# Altium project Camera_Module_Adopter.PrjPcb
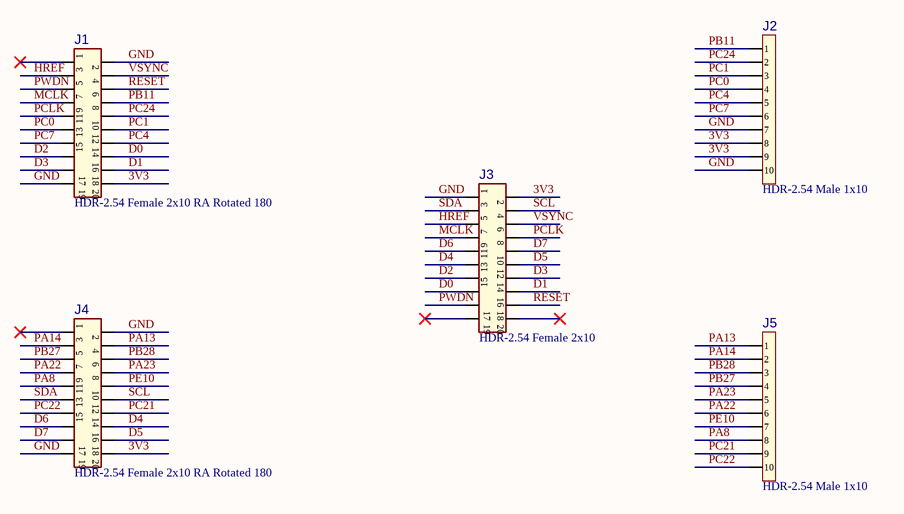
[diagram p0: Sheet1.SchDoc]
1 sheet, 5 parts. Net scope: global (net labels, ports and power ports of the same name join across sheets).
Board file: PCB1.PcbDoc

## Sheet Sheet1.SchDoc
size A; SheetNumber: 1; SheetTotal: 1

### Parts
J1  value HDR-2.54 Female 2x10 RA Rotated 180  [HDR_F_2.54_2x10_RA_180]  (hidden comment: Header 2x10)
J2  value HDR-2.54 Male 1x10  [HDR_M_2.54_1x10]  (hidden comment: Header 1x10)
J3  value HDR-2.54 Female 2x10  [HDR_F_2.54_2x10_SFH11-PBPC-D10-ST-BK]  (hidden comment: Header 2x10)
J4  value HDR-2.54 Female 2x10 RA Rotated 180  [HDR_F_2.54_2x10_RA_180]  (hidden comment: Header 2x10)
J5  value HDR-2.54 Male 1x10  [HDR_M_2.54_1x10]  (hidden comment: Header 1x10)

### Nets
3V3: J1.20 J2.8 J2.9 J3.2 J4.20
D0: J1.16 J3.15
D1: J1.18 J3.16
D2: J1.15 J3.13
D3: J1.17 J3.14
D4: J3.11 J4.16
D5: J3.12 J4.18
D6: J3.9 J4.15
D7: J3.10 J4.17
GND: J1.2 J1.19 J2.7 J2.10 J3.1 J4.2 J4.19
HREF: J1.3 J3.5
MCLK: J1.7 J3.7
PA8: J4.9 J5.8
PA13: J4.4 J5.1
PA14: J4.3 J5.2
PA22: J4.7 J5.6
PA23: J4.8 J5.5
PB11: J1.8 J2.1
PB27: J4.5 J5.4
PB28: J4.6 J5.3
PC0: J1.11 J2.4
PC1: J1.12 J2.3
PC4: J1.14 J2.5
PC7: J1.13 J2.6
PC21: J4.14 J5.9
PC22: J4.13 J5.10
PC24: J1.10 J2.2
PCLK: J1.9 J3.8
PE10: J4.10 J5.7
PWDN: J1.5 J3.17
RESET: J1.6 J3.18
SCL: J3.4 J4.12
SDA: J3.3 J4.11
VSYNC: J1.4 J3.6

Not connected (* = marked no-connect by the designer): J1 1*; J3 19* 20*; J4 1*

### Library data of the parts
J1 J4 = CON1532: Manufacturer 1: Sullins Connector Solutions; Manufacturer Part Number 1: PPPC102LJBN-RC; Description_: CON HDR-2.54 Female 2x10 Rotated 180Degrees Gold TH RT ANGLE; Dev Tools Status: Production; Owner: Jamus Griego; Populated: YES; Restricted Sourcing: No; MCHP-ID: CON1532; Revision: 1; Symbol: Header 2x10; Status: MCL Design; ComponentLink1URL: https://chn-vm-apps.microchip.com/mchprepo/parts/Datasheets/101_P(N)PxCxx2LJBN-RC,_10494-H.pdf; ComponentLink1Description: SVN Datasheet; ComponentLink2URL: C:\ALTIUM_WORK\00001_MCHP-CDB\Datasheets\101_P(N)PxCxx2LJBN-RC,_10494-H.pdf; ComponentLink2Description: Local Datasheet; ComponentLink3URL: C:\ALTIUM_WORK\00001_MCHP-CDB\Library\LibraryRefs\Header 2x10.SchLib; ComponentLink3Description: Open Symbol; ComponentLink4URL: C:\ALTIUM_WORK\00001_MCHP-CDB\Library\Footprints\HDR_F_2.54_2x10_RA_180.PcbLib; ComponentLink4Description: Open Footprint; ComponentLink5Description: Open Footprint 2; ComponentLink6Description: Open Footprint 3; ComponentLink7Description: Open Footprint 4; Type: Header 2.54mm; Category: Connector; Supplier 1: Digi-Key; Supplier Part Number 1: S5563-ND; Quantity Override: 1
J2 J5 = CON0105: Manufacturer 1: Aceconn Technology (Shenzhen); Manufacturer Part Number 1: GPHA101-1002A001B1BA; Description_: CON HDR-2.54 Male 1x10 Gold 5.84MH TH VERT; Dev Tools Status: Production; Populated: Yes; Restricted Sourcing: No; MCHP-ID: CON0105; Revision: 3; Symbol: Header 1x10; Status: MCL Design; ComponentLink1URL: https://chn-vm-apps.microchip.com/mchprepo/parts/Datasheets/TSW-XXX-XX-XXX-X-XX-XXX-MKT.pdf; ComponentLink1Description: SVN Datasheet; ComponentLink2URL: C:\ALTIUM_WORK\00001_MCHP-CDB\Datasheets\TSW-XXX-XX-XXX-X-XX-XXX-MKT.pdf; ComponentLink2Description: Local Datasheet; ComponentLink3URL: C:\ALTIUM_WORK\00001_MCHP-CDB\Library\LibraryRefs\Header 1x10.SchLib; ComponentLink3Description: Open Symbol; ComponentLink4URL: C:\ALTIUM_WORK\00001_MCHP-CDB\Library\Footprints\HDR_M_2.54_1x10.PcbLib; ComponentLink4Description: Open Footprint; ComponentLink5Description: Open Footprint 2; ComponentLink6Description: Open Footprint 3; ComponentLink7Description: Open Footprint 4; Type: Header 2.54mm; Category: Connector; Manufacturer 2: Samtec Inc.; Manufacturer Part Number 2: TSW-110-07-G-S; Manufacturer 3: Samtec Inc.; Manufacturer Part Number 3: TSW-110-07-S-S; Manufacturer 4: Samtec Inc.; Manufacturer Part Number 4: TSW-110-07-L-S; Supplier 1: Aceconn Technology (Shenzhen); Supplier Part Number 1: GPHA101-1002A001B1BA; Supplier 2: Digi-Key; Supplier Part Number 2: SAM1029-10-ND; Supplier 3: Digi-Key; Supplier Part Number 3: SAM1033-10-ND; Supplier 4: Digi-Key; Supplier Part Number 4: SAM1031-10-ND; Quantity Override: 1
J3 = CON1763: Manufacturer 1: Sullins Connector Solutions; Manufacturer Part Number 1: SFH11-PBPC-D10-ST-BK; Description_: CON HDR-2.54 Female 2x10 Gold TH; Dev Tools Status: Production; Owner: Dragos Danaila; Voltage: 1000VAC; Current: 3A; Populated: YES; Restricted Sourcing: No; MCHP-ID: CON1763; Assembly Type: TH; Revision: 2; Symbol: Header 2x10; Status: MCL Design; ComponentLink1URL: https://chn-vm-apps.microchip.com/mchprepo/parts/Datasheets/146_PAGE119_.100_SFH11_SERIES_FEMALE_HDR_ST_RA.pdf; ComponentLink1Description: SVN Datasheet; ComponentLink2URL: C:\ALTIUM_WORK\00001_MCHP-CDB\Datasheets\146_PAGE119_.100_SFH11_SERIES_FEMALE_HDR_ST_RA.pdf; ComponentLink2Description: Local Datasheet; ComponentLink3URL: C:\ALTIUM_WORK\00001_MCHP-CDB\Library\LibraryRefs\Header 2x10.SchLib; ComponentLink3Description: Open Symbol; ComponentLink4URL: C:\ALTIUM_WORK\00001_MCHP-CDB\Library\Footprints\HDR_F_2.54_2x10_SFH11-PBPC-D10-ST-BK.PcbLib; ComponentLink4Description: Open Footprint; ComponentLink5Description: Open Footprint 2; ComponentLink6Description: Open Footprint 3; ComponentLink7Description: Open Footprint 4; Type: Header 2.54mm; Category: Connector; Supplier 1: Digi-Key; Supplier Part Number 1: S9197-ND; Quantity Override: 1; Operating Temperature: -40C to +105C